# EAGLE design HV-main rev1 (EAGLE 8.1.0)
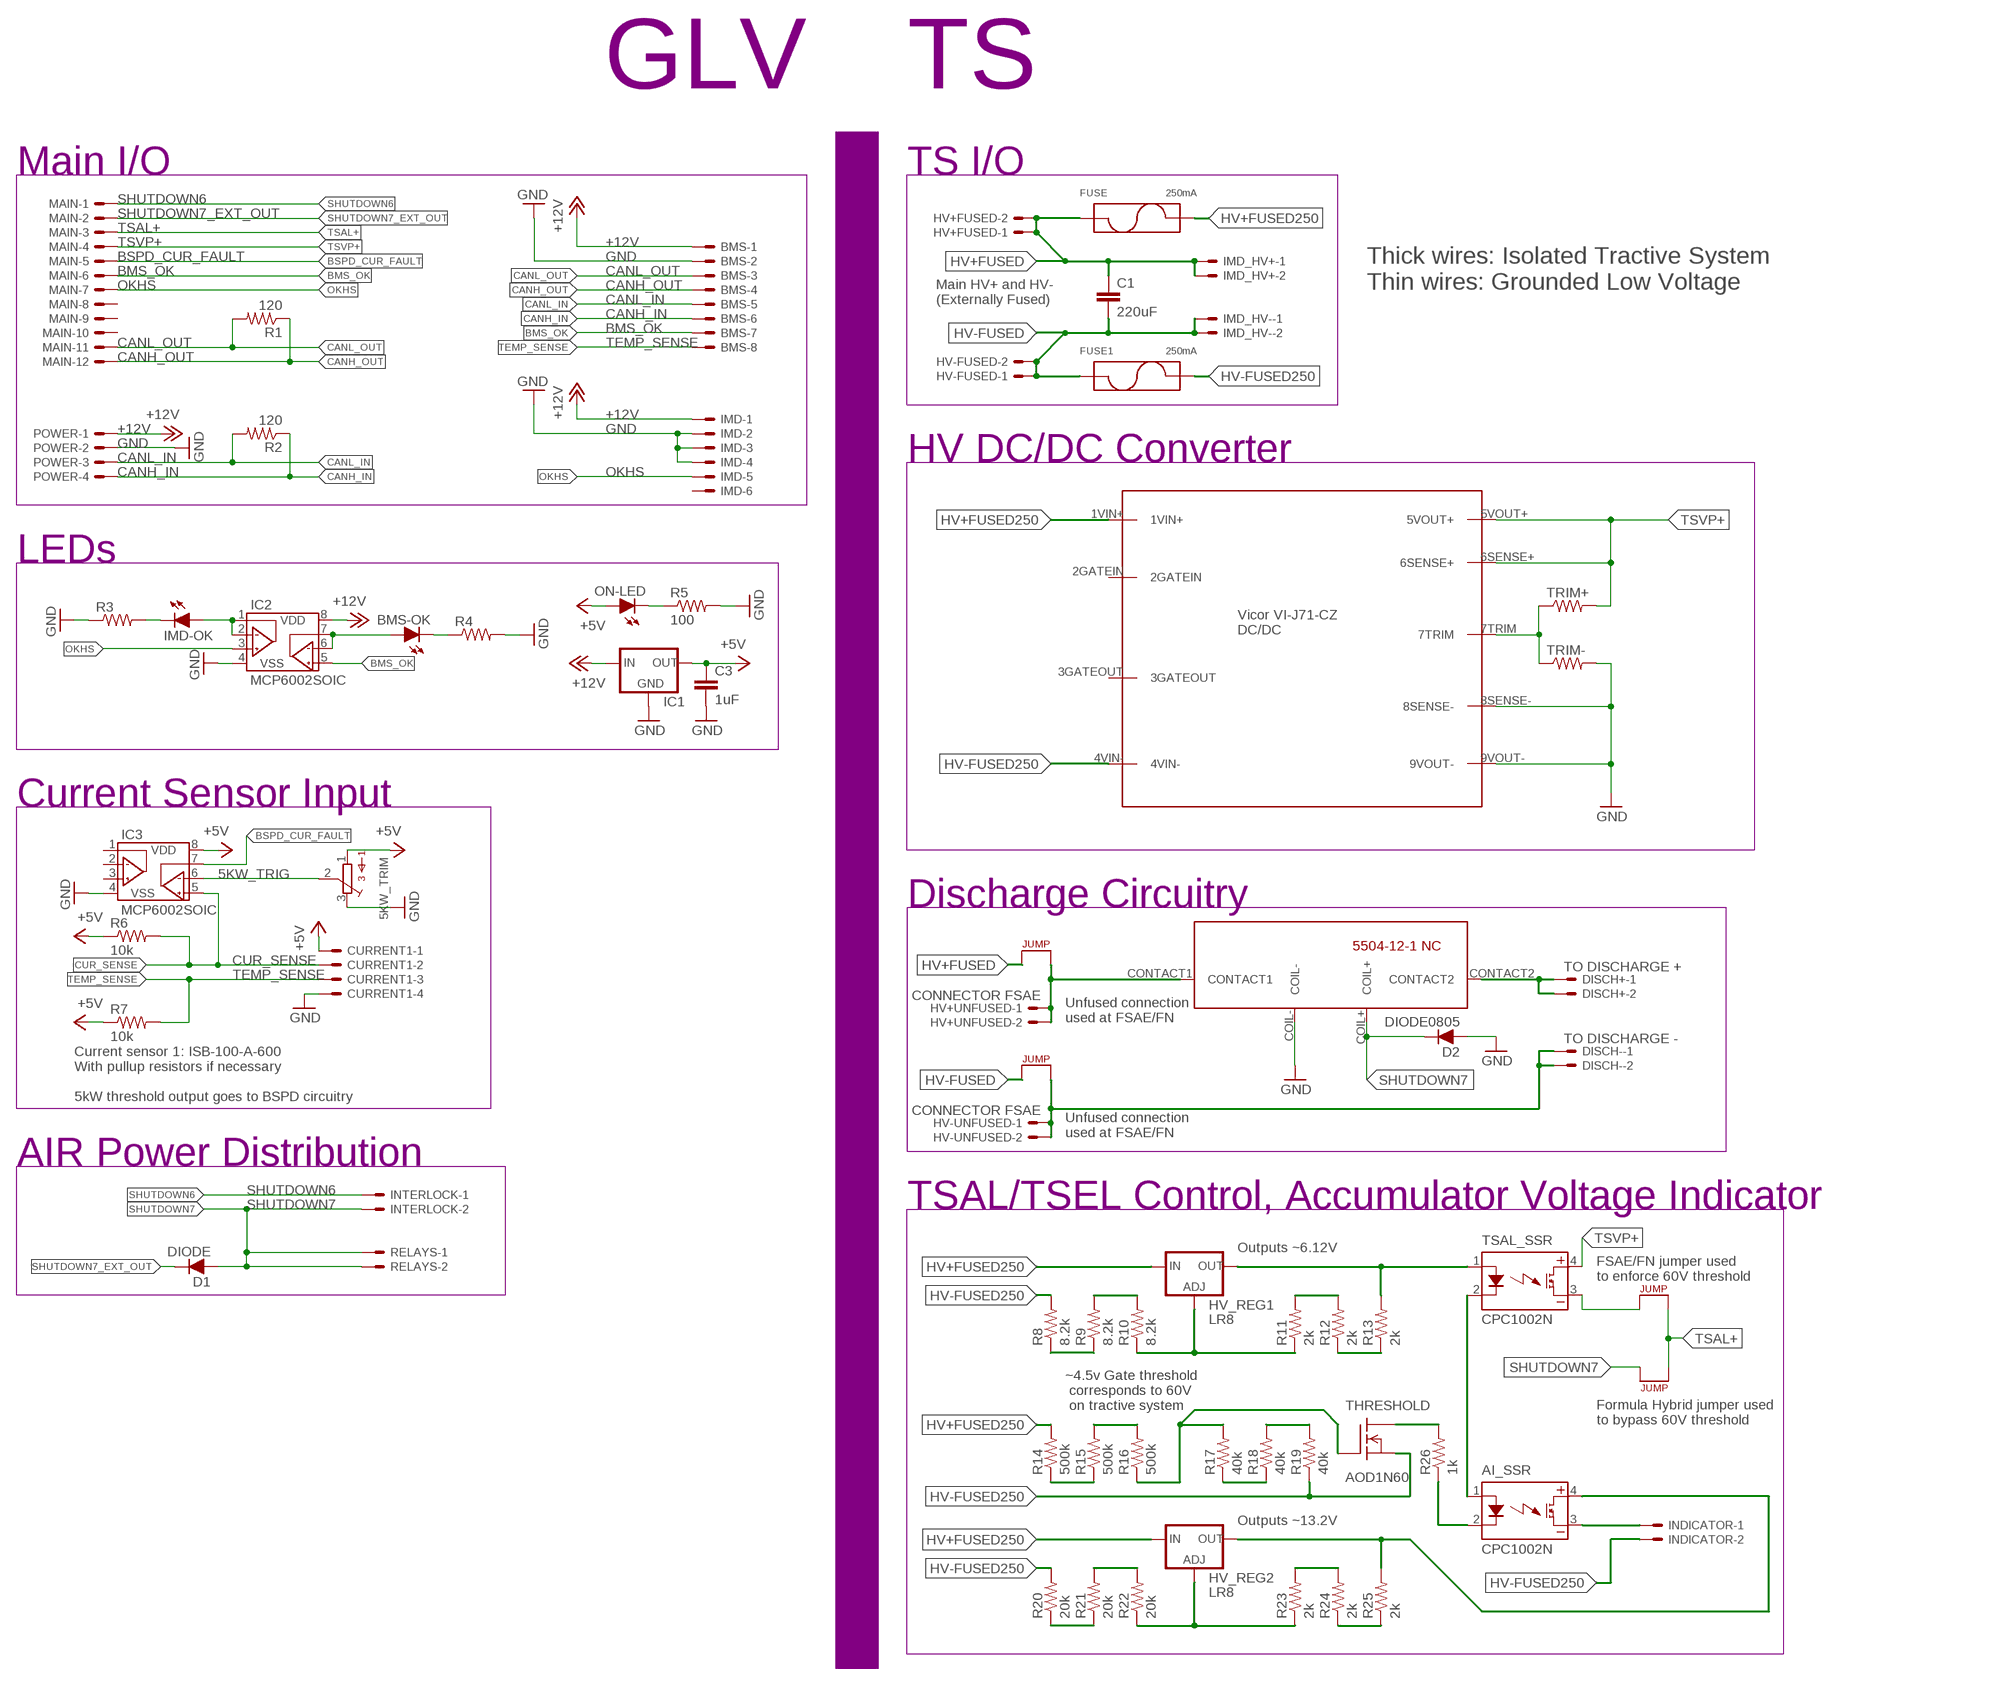
[diagram p0: schematic, sheet 1]

## Parts
5KW_TRIM  TRIMPOT_3296C  [TRIMPOT_3296]
AI_SSR  CPC1002N  [SOP04]
BMS  MINIFIT_5566-8  [MINIFIT_5566-8]
BMS-OK  LED-0805  [LED-805]
C1  220uF  CAP  [LLS2V221MELZ]
C3  1uF  CAP0805  [0805]
CURRENT1  MINIFIT_5566-4  [MINIFIT_5566-4]
D1  DIODE  DIODEDO-41  [DO-41]
D2  DIODE0805  [0805_D]
DISCH+  TO DISCHARGE +  MINIFIT_5566-2  [MINIFIT_5566-2]
DISCH-  TO DISCHARGE -  MINIFIT_5566-2  [MINIFIT_5566-2]
FUSE  250mA  FUSE_MIDGET  [1A3400_38.1MM]
FUSE1  250mA  FUSE_MIDGET  [1A3400_38.1MM]
HV+FUSED  MINIFIT_5566-2  [MINIFIT_5566-2]
HV+UNFUSED  CONNECTOR FSAE  CONNECTOR-2  [MINIFIT_5566-2]
HV-FUSED  MINIFIT_5566-2  [MINIFIT_5566-2]
HV-UNFUSED  CONNECTOR FSAE  CONNECTOR-2  [MINIFIT_5566-2]
HV_REG1  LR8  HV_LIN_REG_LR8SMD  [TO-252]
HV_REG2  LR8  HV_LIN_REG_LR8SMD  [TO-252]
IC1  5VREG_L7805_VERT  [TO-220]
IC2  MCP6002SOIC  [SOIC-08]
IC3  MCP6002SOIC  [SOIC-08]
IMD  CONNECTOR-6  [MINIFIT_5566-6]
IMD-OK  LED-0805  [LED-805]
IMD_HV+  CONNECTOR-2  [MINIFIT_5566-2]
IMD_HV-  CONNECTOR-2  [MINIFIT_5566-2]
INDICATOR  MINIFIT_5566-2  [MINIFIT_5566-2]
INTERLOCK  MINIFIT_5566-2  [MINIFIT_5566-2]
MAIN  CONNECTOR-12  [MINIFIT_5566-12]
ON-LED  LED-0805  [LED-805]
POWER  MINIFIT_5566-4  [MINIFIT_5566-4]
R1  120  RESISTOR0805-RES  [0805]
R2  120  RESISTOR0805-RES  [0805]
R3  RESISTOR0805-RES  [0805]
R4  RESISTOR0805-RES  [0805]
R5  100  RESISTOR0805-RES  [0805]
R6  10k  RESISTOR0805-RES  [0805]
R7  10k  RESISTOR0805-RES  [0805]
R8  8.2k  RESISTOR0805-RES  [0805]
R9  8.2k  RESISTOR0805-RES  [0805]
R10  8.2k  RESISTOR0805-RES  [0805]
R11  2k  RESISTOR0805-RES  [0805]
R12  2k  RESISTOR0805-RES  [0805]
R13  2k  RESISTOR0805-RES  [0805]
R14  500k  RESISTOR0805-RES  [0805]
R15  500k  RESISTOR0805-RES  [0805]
R16  500k  RESISTOR0805-RES  [0805]
R17  40k  RESISTOR0805-RES  [0805]
R18  40k  RESISTOR0805-RES  [0805]
R19  40k  RESISTOR0805-RES  [0805]
R20  20k  RESISTOR0805-RES  [0805]
R21  20k  RESISTOR0805-RES  [0805]
R22  20k  RESISTOR0805-RES  [0805]
R23  2k  RESISTOR0805-RES  [0805]
R24  2k  RESISTOR0805-RES  [0805]
R25  2k  RESISTOR0805-RES  [0805]
R26  1k  RESISTOR0805-RES  [0805]
RELAYS  MINIFIT_5566-2  [MINIFIT_5566-2]
THRESHOLD  AOD1N60  N-CHANNEL_MOSFETAOD1N60  [TO-252]
TRIM+  RESISTOR0805-RES  [0805]
TRIM-  RESISTOR0805-RES  [0805]
TSAL_SSR  CPC1002N  [SOP04]
U$1  JUMPER.3  [AXIAL-0.3]
U$2  JUMPER.3  [AXIAL-0.3]
U$3  JUMPER.3  [AXIAL-0.3]
U$4  JUMPER.3  [AXIAL-0.3]
U$5  HV_DCDC_VI-J71-CZ  [HV_DCDC_VI-J71-CZ]
U$12  5504-12-1-NC  [5504-12-1-NC]

## Nets
5KW_TRIG: 5KW_TRIM.2 IC3.6(VINB-)
+5V: 5KW_TRIM.1 C3.1 CURRENT1.1 IC1.3(OUT) IC3.8(VDD) ON-LED.A R6.1 R7.1
+12V: BMS.1 IC1.1(IN) IC2.8(VDD) IMD.1 POWER.1
BMS_OK: BMS.7 IC2.5(VINB+) MAIN.6
BSPD_CUR_FAULT: IC3.7(VOUTB) MAIN.5
CANH_IN: BMS.6 POWER.4 R2.1
CANH_OUT: BMS.4 MAIN.12 R1.1
CANL_IN: BMS.5 POWER.3 R2.2
CANL_OUT: BMS.3 MAIN.11 R1.2
CUR_SENSE: CURRENT1.2 IC3.5(VINB+) R6.2
DISCHARGE1: HV+UNFUSED.1 HV+UNFUSED.2 U$3.P$2 U$12.CONTACT1
DISCHARGE2: DISCH+.1 DISCH+.2 U$12.CONTACT2
DISCHARGE3: DISCH-.1 DISCH-.2 HV-UNFUSED.1 HV-UNFUSED.2 U$4.P$2
GND: 5KW_TRIM.3 BMS.2 C3.2 CURRENT1.4 D2.A IC1.2(GND) IC2.4(VSS) IC3.4(VSS) IMD.2 IMD.3 IMD.4 POWER.2 R3.1 R4.2 R5.2 TRIM-.2 U$5.8SENSE- U$5.9VOUT- U$12.COIL-
HV+FUSED: C1.P$1 FUSE.P1 FUSE.P2(P1) HV+FUSED.1 HV+FUSED.2 IMD_HV+.1 IMD_HV+.2 U$3.P$1
HV+FUSED250: FUSE.N3(P2) FUSE.N4(P2) HV_REG1.1(IN) HV_REG2.1(IN) R14.2 U$5.1VIN+
HV-FUSED: C1.P$2 FUSE1.P1 FUSE1.P2(P1) HV-FUSED.1 HV-FUSED.2 IMD_HV-.1 IMD_HV-.2 U$4.P$1
HV-FUSED250: FUSE1.N3(P2) FUSE1.N4(P2) INDICATOR.2 R8.2 R19.1 R20.2 THRESHOLD.3(S) U$5.4VIN-
N$1: AI_SSR.4(DC+) HV_REG2.2(TAB)(OUT) R25.2
N$2: HV_REG1.2(TAB)(OUT) R13.2 TSAL_SSR.1(CONTROL+)
N$3: ON-LED.C R5.1
N$4: TSAL_SSR.3(DC-) U$1.P$1
N$5: AI_SSR.2(CONTROL-) R26.1
N$6: AI_SSR.1(CONTROL+) TSAL_SSR.2(CONTROL-)
N$7: AI_SSR.3(DC-) INDICATOR.1
N$8: R8.1 R9.1
N$9: R26.2 THRESHOLD.2(TAB)(D)
N$10: R14.1 R15.1
N$11: R15.2 R16.2
N$12: R17.1 R18.1
N$13: R18.2 R19.2
N$14: R9.2 R10.2
N$15: HV_REG2.3(ADJ) R22.1 R23.1
N$16: R11.2 R12.2
N$17: R12.1 R13.1
N$18: HV_REG1.3(ADJ) R10.1 R11.1
N$19: R23.2 R24.2
N$20: R24.1 R25.1
N$21: R21.2 R22.2
N$22: R16.1 R17.2 THRESHOLD.1(G)
N$23: R20.1 R21.1
N$42: IC2.1(VOUTA) IC2.2(VINA-) IMD-OK.A
N$43: BMS-OK.A IC2.6(VINB-) IC2.7(VOUTB)
N$44: BMS-OK.C R4.1
N$45: IMD-OK.C R3.2
OKHS: IC2.3(VINA+) IMD.5 MAIN.7
SHUTDOWN6: INTERLOCK.1 MAIN.1
SHUTDOWN7: D1.A D2.C INTERLOCK.2 RELAYS.1 RELAYS.2 U$2.P$2 U$12.COIL+
SHUTDOWN7_EXT_OUT: D1.C MAIN.2
TEMP_SENSE: BMS.8 CURRENT1.3 R7.2
TRIM: TRIM+.1 TRIM-.1 U$5.7TRIM
TSAL+: MAIN.3 U$1.P$2 U$2.P$1
TSVP+: MAIN.4 TRIM+.2 TSAL_SSR.4(DC+) U$5.5VOUT+ U$5.6SENSE+
Unconnected: IC3.1(VOUTA) IC3.2(VINA-) IC3.3(VINA+) IMD.6 MAIN.8 MAIN.9 MAIN.10 U$5.2GATEIN U$5.3GATEOUT

## Notes on the sheet
- GLV
- TS
- Main I/O | TS I/O
- Thick wires: Isolated Tractive System
  Thin wires: Grounded Low Voltage
- Main HV+ and HV-
  (Externally Fused)
- HV DC/DC Converter
- LEDs
- Current Sensor Input
- Discharge Circuitry
- Unfused connection
  used at FSAE/FN
- Current sensor 1: ISB-100-A-600
  With pullup resistors if necessary
  
  5kW threshold output goes to BSPD circuitry
- Unfused connection
  used at FSAE/FN
- AIR Power Distribution
- TSAL/TSEL Control, Accumulator Voltage Indicator
- Outputs ~6.12V
- FSAE/FN jumper used
  to enforce 60V threshold
- ~4.5v Gate threshold
   corresponds to 60V
   on tractive system
- Formula Hybrid jumper used
  to bypass 60V threshold
- Outputs ~13.2V

## Library data of the parts
5KW_TRIM = HyTechDevices:TRIMPOT_3296: 3296 Series 3/8" Square Trimmer Source <https://github.com/chiengineer/Eagle-Libraries/blob/master/Potentiometers/bourns.lbr>
AI_SSR TSAL_SSR = HyTechDevices:CPC1002N: IXYS Solid State Relay .7A
BMS = HyTechDevices:MINIFIT_5566-8: Mini-Fit Junior connector 8 pole Source: http://www.molex.com; OC_FARNELL: unknown; OC_NEWARK: unknown
BMS-OK IMD-OK ON-LED = HyTechDevices:LED: Light Emitting Diode (LED) Source: Dangerous Prototypes Eagle Library <https://github.com/DangerousPrototypes/Eagle_Part_Library>
C1 C3 = HyTechDevices:CAP: Capacitor Standard 0603 ceramic capacitor, and 0.1" leaded capacitor.
CURRENT1 POWER = HyTechDevices:MINIFIT_5566-4: Mini-Fit Junior connector 4 pole Source: http://www.molex.com; OC_FARNELL: unknown; OC_NEWARK: unknown
D1 D2 = HyTechDevices:DIODE: DIODE general purpose rectifier
DISCH+ DISCH- HV+FUSED HV-FUSED INDICATOR INTERLOCK RELAYS = HyTechDevices:MINIFIT_5566-2: Mini-Fit Junior connector 2 pole Source: http://www.molex.com; OC_FARNELL: 1822072; OC_NEWARK: unknown
FUSE FUSE1 = HyTechDevices:FUSE: Fuse/Fuseclips Keystone Electronics 3568 Fuse Mouser Part <http://www.mouser.com/ProductDetail/Keystone-Electronics/3568> Datasheet <http://www.mouser.com/ds/2/215/568-742601.pdf> Bussman/Eaton Midget Fuse Clip 1A3400 <http://www.mouser.com/ProductDetail/Bussmann-Eaton/BK-1A3400-09-R/?qs=sGAEpiMZZMuG%252bgnN5hGYGzzlAelq2OxnKqVSMVjq8I4%3d> Schurter 0751.0110 Brass Fuse Clip Datasheet <http://www.mouser.com/ds/2/358/typ_OG__Clip__5x20-2553.pdf>
HV+UNFUSED HV-UNFUSED IMD_HV+ IMD_HV- = HyTechDevices:CONNECTOR-2: Mini-Fit Junior connector 2 pole Source: http://www.molex.com; OC_FARNELL: 1822072; OC_NEWARK: unknown
HV_REG1 HV_REG2 = HyTechDevices:HV_LIN_REG_LR8
IC1 = HyTechDevices:5VREG_L7805: Voltage Regulator Switching 5v regulator Datasheet <http://power.murata.com/data/power/oki-78sr.pdf> Standard 7805 5V regulator. IGO (Input Ground Output). Spark Fun Electronics SKU : COM-00107 Datasheet <http://www.mouser.com/ds/2/308/MC7800-D-94905.pdf>
IC2 IC3 = HyTechDevices:MCP6002: Microchip MCP6002 Dual Channel Op Amp
IMD = HyTechDevices:CONNECTOR-6: Mini-Fit Junior connector 6 pole Source: http://www.molex.com; MPN: 95566-61002; OC_FARNELL: unknown; OC_NEWARK: 22K8620
MAIN = HyTechDevices:CONNECTOR-12: Mini-Fit Junior connector 12 pole Source: http://www.molex.com; OC_FARNELL: unknown; OC_NEWARK: unknown
R1-R26 TRIM+ TRIM- = HyTechDevices:RESISTOR: Resistor Basic schematic elements and footprints for 0603, 1206, and PTH resistors.
THRESHOLD = HyTechDevices:N-CHANNEL_MOSFET: Generic N-Channel MOSFET
U$1-U$4 = HyTechDevices:JUMPER: Jumper for changing operation of a device
U$5 = HyTechDevices:HV_DCDC_VI-J71-CZ: Vicor-Corporation VI-J71-CZ Product Page <https://www.digikey.com/product-detail/en/vicor-corporation/VI-J71-CZ/1102-1486-ND/2996194> Datasheet <http://cdn.vicorpower.com/documents/datasheets/ds_vi-j00.pdf>
U$12 = HyTechDevices:5504-12-1-NC: Relay 5504-12-1 Normally Closed(Form B)

## Board
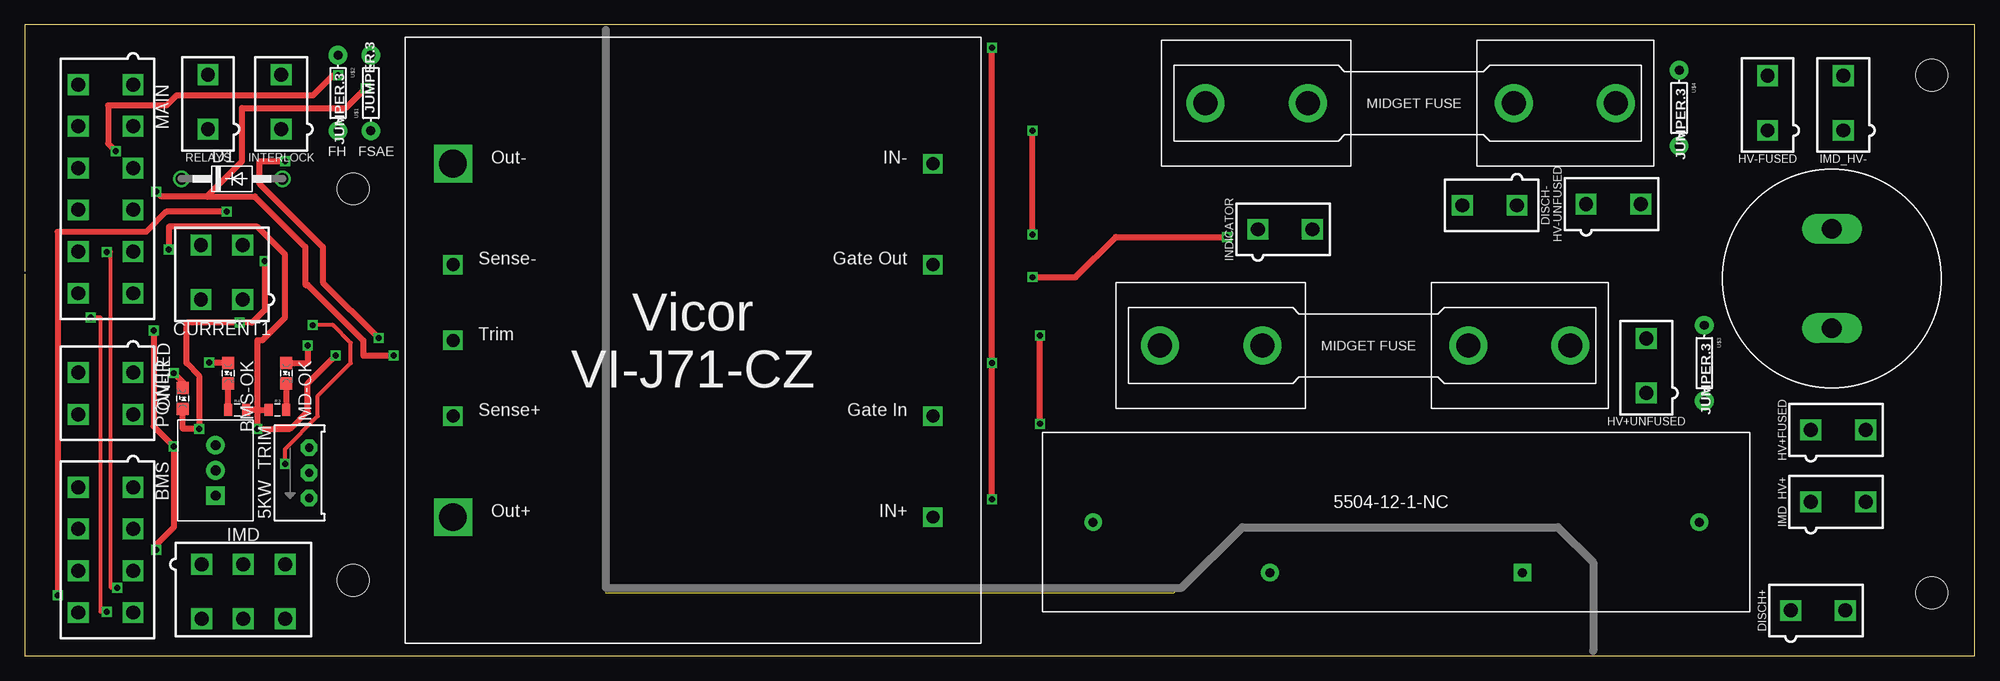
[diagram p1: board, top side]
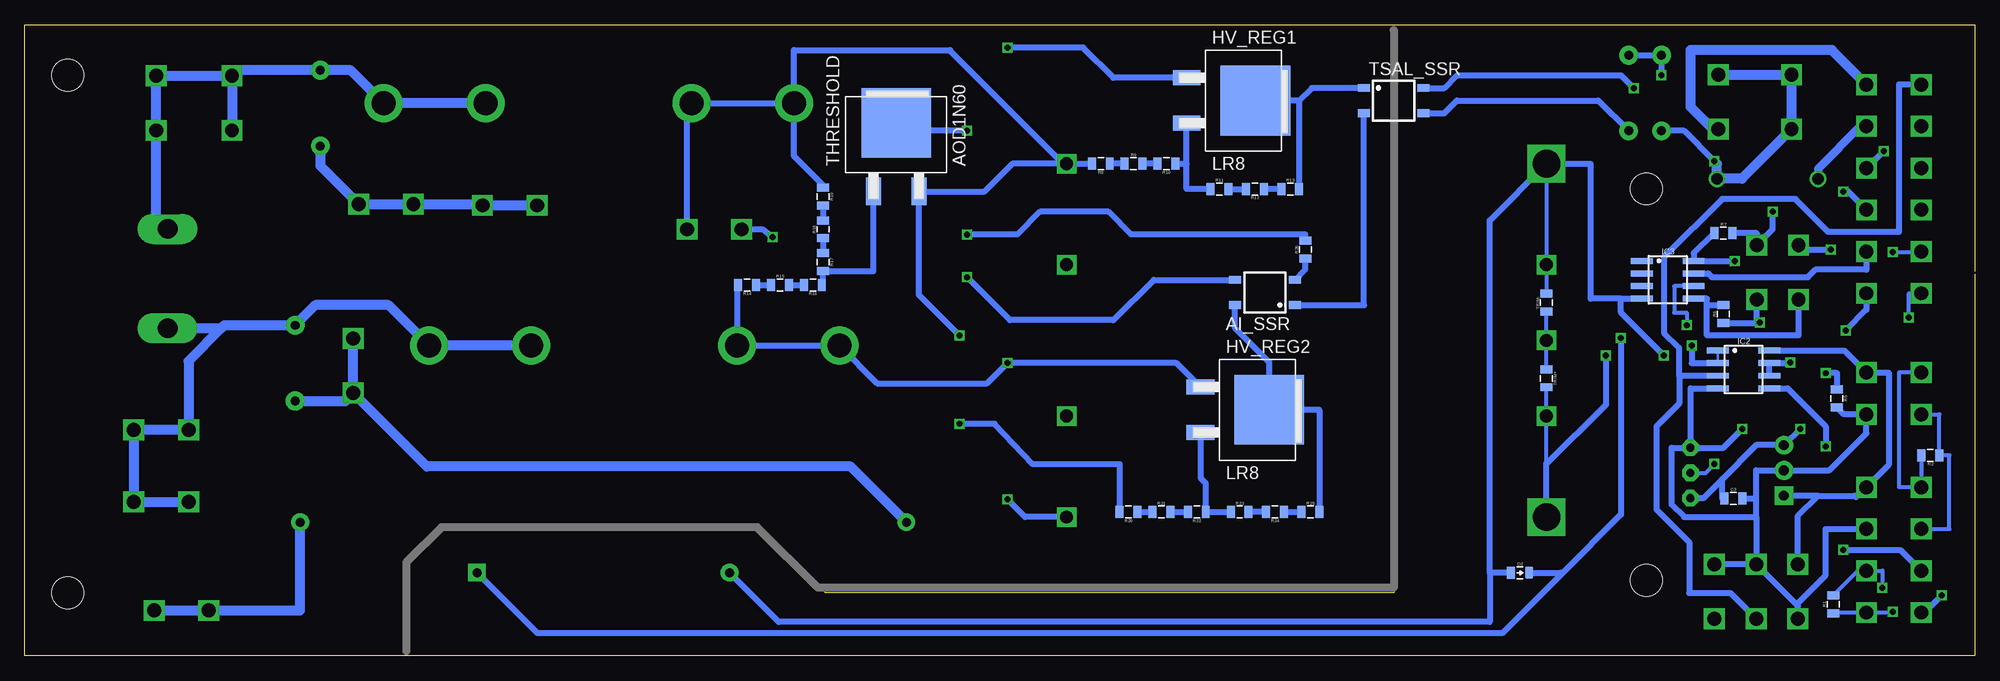
[diagram p2: board, bottom side, seen from below]

Size 196.09 x 63.5 mm. Coordinates in mm from the lower left corner, seen from the top.
Outline: 0,38.69 0,63.5 196.09,63.5 196.09,0 0,0 0,38.43
Copper layers (1*16): Top 0.035mm / dielectric 1.5mm / Bottom 0.035mm
Design rules "default": minimum track width 10mil, minimum drill 24mil, track to track 8mil, track to pad 8mil, pad to pad 8mil, via to via 8mil, smd to smd 8mil, copper to edge 40mil, drill to drill 8mil, minimum pad ring 10mil, minimum via ring 8mil, stop-mask expansion 4mil, vias tented up to drill 0mil, thermal gap 10mil
Holes 3.2 mm at 33.02,46.99 33.02,7.62 191.77,6.35 191.77,58.42

### Footprints (pad centres in the part's own frame; a part is rotated, then mirrored left to right if it is on the bottom)
TRIMPOT_3296 = drill 0.813 pad 1.676 octagon: 1 2.54,1.27; 2 0,1.27; 3 -2.54,1.27
SOP04 = smd 0.8 x 1.2: 1 -1.27,-3; 2 1.27,-3; 3 1.27,3; 4 -1.27,3
MINIFIT_5566-8 = drill 1.4 square: 1 6.3,-2.75; 2 2.1,-2.75; 3 -2.1,-2.75; 4 -6.3,-2.75; 5 6.3,2.75; 6 2.1,2.75; 7 -2.1,2.75; 8 -6.3,2.75
LED-805 = smd 1.2 x 1.2: A 0,-1.05; C 0,1.05
LLS2V221MELZ = drill 2 long: P$1 -5,0; P$2 5,0
0805 = smd 0.8 x 1.2: 1 -0.9,0; 2 0.9,0
MINIFIT_5566-4 = drill 1.4 square: 1 2.1,-2.75; 2 -2.1,-2.75; 3 2.1,2.75; 4 -2.1,2.75
DO-41 = drill 1.118: A 5.08,0; C -5.08,0
0805_D = smd 0.8 x 1.2: A -0.9,0; C 0.9,0
MINIFIT_5566-2 = drill 1.4 square: 1 0,-2.75; 2 0,2.75
1A3400_38.1MM = drill 2.413 pad 3.81: N3 30.988,0; N4 41.275,0; P1 0,0; P2 10.287,0
TO-252 = smd 1.499 x 2.794: 1 -2.286,0; 3 2.286,0 | smd 7.01 x 7.01: 2(TAB) 0,6.909
TO-220 = drill 1 pad 1.88 square: 1 -2.54,0 | drill 1 pad 1.88: 2 0,0; 3 2.54,0
SOIC-08 = smd 0.6 x 2.2: 1 -1.905,-2.6; 2 -0.635,-2.6; 3 0.635,-2.6; 4 1.905,-2.6; 5 1.905,2.6; 6 0.635,2.6; 7 -0.635,2.6; 8 -1.905,2.6
MINIFIT_5566-6 = drill 1.4 square: 1 4.2,-2.75; 2 0,-2.75; 3 -4.2,-2.75; 4 4.2,2.75; 5 0,2.75; 6 -4.2,2.75
MINIFIT_5566-12 = drill 1.4 square: 1 10.5,-2.75; 2 6.3,-2.75; 3 2.1,-2.75; 4 -2.1,-2.75; 5 -6.3,-2.75; 6 -10.5,-2.75; 7 10.5,2.75; 8 6.3,2.75; 9 2.1,2.75; 10 -2.1,2.75; 11 -6.3,2.75; 12 -10.5,2.75
AXIAL-0.3 = drill 0.9 pad 1.88: P$1 -3.81,0; P$2 3.81,0
HV_DCDC_VI-J71-CZ = drill 1.3 square: 1VIN+ 5.08,-12.7; 2GATEIN 5.08,-22.86; 3GATEOUT 5.08,-38.1; 4VIN- 5.08,-48.26; 6SENSE+ 53.34,-22.86; 7TRIM 53.34,-30.48; 8SENSE- 53.34,-38.1 | drill 2.8 square: 5VOUT+ 53.34,-12.7; 9VOUT- 53.34,-48.26
5504-12-1-NC = drill 0.9 pad 1.778 square: COIL+ 48.26,-14.097 | drill 0.9 pad 1.778: COIL- 22.86,-14.097; CONTACT1 5.08,-9.017; CONTACT2 66.04,-9.017

### Placement (x,y rotation side)
5KW_TRIM  27.3,18.41 270 top
AI_SSR  71.37,36.58 90 bottom
BMS  8.13,10.67 90 top
BMS-OK  20.45,28.45 180 top
C1  181.74,37.97 90 top
C3  24.26,15.88 0 bottom
CURRENT1  19.81,38.61 0 top
D1  20.83,48.01 0 top
D2  45.72,8.38 0 bottom
DISCH+  180.34,4.57 270 top
DISCH-  147.32,45.34 90 top
FUSE  155.45,31.24 180 top
FUSE1  160.02,55.63 180 top
HV+FUSED  182.37,22.73 270 top
HV+UNFUSED  163.07,29.21 0 top
HV-FUSED  175.26,55.63 0 top
HV-UNFUSED  159.77,45.47 270 top
HV_REG1  79.25,55.88 270 bottom
HV_REG2  77.85,24.77 270 bottom
IC1  19.18,18.67 90 top
IC2  23.24,28.83 270 bottom
IC3  30.86,37.85 270 bottom
IMD  21.97,6.48 180 top
IMD-OK  26.29,28.45 180 top
IMD_HV+  182.37,15.49 270 top
IMD_HV-  182.88,55.63 0 top
INDICATOR  126.75,42.93 270 top
INTERLOCK  25.78,55.75 0 top
MAIN  8.13,46.99 90 top
ON-LED  15.88,25.91 0 top
POWER  8.13,26.42 90 top
R1  14.22,5.21 90 bottom
R2  4.45,20.19 180 bottom
R3  25.4,24.77 0 top
R4  21.34,24.77 0 top
R5  13.84,25.91 270 bottom
R6  25.27,34.42 90 bottom
R7  25.27,42.55 0 bottom
R8  87.88,49.53 180 bottom
R9  84.58,49.53 0 bottom
R10  81.28,49.53 180 bottom
R11  75.95,46.99 0 bottom
R12  72.39,46.99 180 bottom
R13  68.83,46.99 0 bottom
R14  123.44,37.34 180 bottom
R15  120.14,37.34 0 bottom
R16  116.84,37.34 180 bottom
R17  115.82,39.62 270 bottom
R18  115.82,42.93 90 bottom
R19  115.82,46.23 270 bottom
R20  85.09,14.48 180 bottom
R21  81.79,14.48 0 bottom
R22  78.23,14.48 180 bottom
R23  73.91,14.48 0 bottom
R24  70.36,14.48 180 bottom
R25  66.8,14.48 0 bottom
R26  67.31,40.89 90 bottom
RELAYS  18.41,55.75 0 top
THRESHOLD  108.46,46.74 0 bottom
TRIM+  43.05,27.94 270 bottom
TRIM-  43.05,35.56 90 bottom
TSAL_SSR  58.42,55.88 270 bottom
U$1  34.8,56.64 90 top
U$2  31.5,56.64 270 top
U$3  168.91,29.46 270 top
U$4  166.37,55.12 270 top
U$5  96.39,1.27 180 top
U$12  102.36,22.48 0 top

### Tracks (layer width: path | path; a pad name or v marks a point on that pad's centre or on a via)
5KW_TRIG  (via drill 0.6)
  Top 0.406: v28.96,33.27 30.99,33.27 32.77,31.5 32.77,29.46 29.46,26.16 29.46,24.13 26.16,20.83 v26.16,19.3
  Bottom 0.406: IC3.6 30.23,37.21 30.23,34.54 28.96,34.54 v28.96,33.27 | 5KW_TRIM.2 27.05,18.41 v26.16,19.3
+5V  (via drill 0.6)
  Top 0.61: 15.91,24.89 ON-LED.A 15.88,22.86 v17.53,22.86 17.53,28.19 16.26,29.46 16.26,33.53 v21.59,33.53 22.86,33.53 24.13,34.8 v24.13,39.75
  Bottom 0.61: 5KW_TRIM.1 27.3,15.88 25.4,17.78 | 25.4,17.78 21.97,21.21 IC1.3 v17.53,22.86 | C3.1 25.4,15.88 25.4,17.78 | R7.1 28.26,40.51 IC3.8 v24.13,39.75 | 21.91,33.53 v21.59,33.53 | 21.91,33.53 CURRENT1.1 | R6.1 21.91,33.52 21.91,33.53
+12V
  Bottom 0.61: 17.77,10.17 IMD.1 17.77,14.11 15.75,16.13 | 15.75,16.13 IC1.1 | 15.75,16.13 12.06,16.13 11.94,16 10.97,16.97 BMS.1 8.64,19.21 8.64,28.52 POWER.1 13.1,30.73 IC2.8
BMS_OK  (via drill 0.6)
  Top 0.61: v13.21,10.67 13.21,11.18 14.99,12.95 v14.99,21.08 12.95,23.11 v12.95,32.77
  Bottom 0.61: IC2.5 18.8,26.92 14.99,23.11 v14.99,21.08 | v13.21,10.67 7.48,10.67 BMS.7 | MAIN.6 10.88,34.84 v12.95,32.77
BSPD_CUR_FAULT
  Bottom 0.61: MAIN.5 10.88,38.86 16,38.86 16.76,38.1 26.42,38.1 26.8,38.48 IC3.7
CANH_IN
  Bottom 0.406: POWER.4 3.54,24.32 R2.1 2.54,20.19 2.54,12.77 BMS.6
CANH_OUT  (via drill 0.6)
  Top 0.406: v8.26,4.45 7.62,4.45 7.62,34.04 v6.6,34.04
  Bottom 0.406: R1.1 14.22,4.37 BMS.4 8.26,4.37 v8.26,4.45 | v6.6,34.04 6.6,36.49 MAIN.12
CANL_IN
  Bottom 0.406: POWER.3 7.62,28.52 7.62,16.97 BMS.5 5.38,20.19 R2.2
CANL_OUT  (via drill 0.6)
  Top 0.406: v9.27,6.86 8.64,6.86 8.64,40.64 v8.26,40.64
  Bottom 0.406: R1.2 11.76,8.57 BMS.3 9.27,8.57 v9.27,6.86 | v8.26,40.64 5.63,40.64 MAIN.11
CUR_SENSE
  Bottom 0.61: CURRENT1.2 17.71,32.26 26.92,32.26 26.92,35.31 | 26.92,35.31 25.27,35.31 R6.2 | 26.92,35.31 26.92,35.94 IC3.5
DISCHARGE1
  Bottom 1.016: HV+UNFUSED.1 HV+UNFUSED.2 | U$12.CONTACT1 113.03,19.05 155.66,19.05 HV+UNFUSED.1 | U$3.P$2 163.87,25.65 HV+UNFUSED.1
DISCHARGE2
  Bottom 1.016: DISCH+.2 DISCH+.1 168.4,4.57 U$12.CONTACT2
DISCHARGE3
  Bottom 1.016: DISCH-.2 DISCH-.1 150.07,45.47 HV-UNFUSED.1 HV-UNFUSED.2 166.37,49.32 U$4.P$2
GND  (via drill 0.6)
  Top 0.61: 23.37,24.77 R4.2 | 23.37,24.77 R3.1 | 23.37,24.77 v23.37,22.86 26.67,22.86 28.45,24.64 28.45,27.43 v31.24,30.23 | v14.48,40.89 14.48,43.18 23.37,43.18 26.16,40.39 26.16,34.04 23.88,31.75 23.37,31.75 23.37,24.77
  Bottom 0.406: TRIM-.2 U$5.8SENSE- U$5.9VOUT-
  Bottom 0.61: IMD.2 IMD.3 | IMD.4 17.77,5.03 18.06,5.31 | 18.06,5.31 IMD.2 | 21.97,15.88 21.97,18.67 IC1.2 14.61,18.67 10.88,22.4 POWER.2 13.15,24.32 R5.2 | 21.97,13.97 21.97,15.88 | 21.97,13.97 IMD.2 | C3.2 21.97,15.88 | 5KW_TRIM.3 30.48,20.95 30.48,15.24 29.21,13.97 21.97,13.97 | 5KW_TRIM.3 25.27,20.95 v23.37,22.86 | 18.06,5.31 17.8,5.31 14.99,8.13 14.99,12.77 BMS.2 | 5KW_TRIM.3 28.57,26.92 IC2.4 | CURRENT1.4 17.25,40.89 v14.48,40.89 | U$5.9VOUT- 38.61,49.53 38.61,35.94 35.56,35.94 | 35.56,35.94 IC3.4 | 43.18,49.53 U$5.9VOUT- | v31.24,30.23 35.56,34.54 35.56,35.94 | U$5.9VOUT- 48.77,43.81 48.77,8.38 | 48.77,8.38 48.77,3.43 120.27,3.43 U$12.COIL- | D2.A 48.77,8.38
HV+FUSED
  Bottom 1.016: FUSE.P2 FUSE.P1 159.51,35.31 166.88,35.31 U$3.P$1 176.02,33.27 176.32,32.97 | IMD_HV+.1 IMD_HV+.2 HV+FUSED.2 HV+FUSED.1 179.62,29.67 176.32,32.97 | C1.P$1 176.32,32.97
HV+FUSED250  (via drill 0.6)
  Top 0.61: v97.28,61.21 v97.28,29.46 v97.28,15.75
  Bottom 0.61: v97.28,61.21 89.66,61.21 86.61,58.17 HV_REG1.1 | HV_REG2.1 80.26,29.46 v97.28,29.46 99.31,27.43 110.36,27.43 FUSE.N4 FUSE.N3 124.46,37.22 R14.2 | U$5.1VIN+ 95.5,13.97 v97.28,15.75
HV-FUSED
  Bottom 1.016: HV-FUSED.2 HV-FUSED.1 | FUSE1.P2 FUSE1.P1 163.32,58.93 U$4.P$1 174.71,58.93 HV-FUSED.2 | HV-FUSED.2 IMD_HV-.2 IMD_HV-.1 182.88,44.12 C1.P$2
HV-FUSED250  (via drill 0.6)
  Top 0.61: v102.11,23.37 v102.11,32.26
  Bottom 0.61: 91.69,49.53 U$5.4VIN- R8.2 | 91.69,49.53 96.77,49.53 99.57,46.74 THRESHOLD.3 106.17,36.32 v102.11,32.26 | FUSE1.N4 FUSE1.N3 129.5,55.16 INDICATOR.2 | FUSE1.N4 118.75,60.96 103,60.96 103,60.83 91.69,49.53 | v102.11,23.37 98.55,23.37 94.74,19.3 85.99,19.3 R20.2 | FUSE1.N4 118.75,50.3 115.82,47.38 R19.1
N$1
  Bottom 0.61: R25.2 65.9,24.77 HV_REG2.2(TAB) 70.94,29.54 74.37,32.97 AI_SSR.4
N$2
  Bottom 0.61: 73.36,57.15 HV_REG1.2(TAB) 67.93,55.88 | 67.93,55.88 R13.2 | 67.93,55.88 66.66,57.15 TSAL_SSR.1
N$3  (via drill 0.6)
  Top 0.61: v14.99,28.45 15.88,27.56 ON-LED.C
  Bottom 0.61: v14.99,28.45 13.84,28.45 R5.1
N$4
  Bottom 0.61: U$1.P$1 37.85,55.88 52.07,55.88 53.34,54.61 TSAL_SSR.3
N$5
  Bottom 0.61: R26.1 67.31,38.91 AI_SSR.2
N$6
  Bottom 0.61: AI_SSR.1 61.42,35.31 TSAL_SSR.2
N$7  (via drill 0.6)
  Top 0.61: v120.9,42.16 109.73,42.16 105.66,38.1 v101.35,38.1
  Bottom 0.61: AI_SSR.3 82.55,37.85 86.61,33.78 97.03,33.78 v101.35,38.1 | INDICATOR.1 121.92,42.93 v120.9,42.16
N$8
  Bottom 0.61: R9.1 R8.1
N$9  (via drill 0.6)
  Top 0.61: v101.35,42.42 v101.35,52.83
  Bottom 0.61: R26.2 67.31,42.42 84.84,42.42 87.12,44.7 93.98,44.7 96.27,42.42 v101.35,42.42 | v101.35,52.83 107.64,52.83 THRESHOLD.2(TAB)
N$10
  Bottom 0.61: R14.1 R15.1
N$11
  Bottom 0.61: R15.2 R16.2
N$12
  Bottom 0.61: R18.1 R17.1
N$13
  Bottom 0.61: R19.2 R18.2
N$14
  Bottom 0.61: R10.2 R9.2
N$15
  Bottom 0.61: R23.1 R22.1 77.33,17.39 77.85,17.91 HV_REG2.3 77.72,22.48
N$16
  Bottom 0.61: R11.2 R12.2
N$17
  Bottom 0.61: R13.1 R12.1
N$18
  Bottom 0.61: 79.25,49.53 HV_REG1.3 | R10.1 79.25,49.53 | 79.25,49.53 79.25,46.99 R11.1
N$19
  Bottom 0.61: R24.2 R23.2
N$20
  Bottom 0.61: R24.1 R25.1
N$21
  Bottom 0.61: R21.2 R22.2
N$22
  Bottom 0.61: THRESHOLD.1 110.74,38.72 R17.2 115.82,37.34 R16.1
N$23
  Bottom 0.61: R20.1 R21.1
N$24  (6 unrouted)
N$42  (via drill 0.6)
  Top 0.61: IMD-OK.A 28.48,29.5 28.48,31.24 v28.45,31.24
  Bottom 0.254: IC2.1 IC2.2
  Bottom 0.61: IC2.2 28.45,29.46 v28.45,31.24
N$43  (via drill 0.6)
  Top 0.61: v18.54,29.51 20.18,29.51 BMS-OK.A
  Bottom 0.61: IC2.6 IC2.7 18.59,29.46 v18.54,29.51
N$44
  Top 0.61: BMS-OK.C R4.1
N$45
  Top 0.61: IMD-OK.C R3.2
OKHS
  Bottom 0.61: IMD.5 24.59,6.35 28.7,6.35 28.7,11.43 32,14.73 32,23.11 29.72,25.4 29.72,28.19 | MAIN.7 7.62,57.49 7.62,42.67 14.73,42.67 18.03,45.97 25.4,45.97 31.24,40.13 31.24,32.51 29.72,30.99 29.72,28.19 | IC2.3 29.72,28.19
SHUTDOWN6
  Bottom 1.016: INTERLOCK.1 26.33,53 28.57,55.24 28.57,60.96 14.35,60.96 MAIN.1
SHUTDOWN7  (via drill 0.6)
  Top 0.61: v26.16,49.78 23.62,49.78 23.62,47.5 29.97,41.15 29.97,37.59 v35.56,32
  Bottom 0.61: U$2.P$2 29.21,52.83 v26.16,49.78 25.91,49.53 | v35.56,32 35.56,14.22 41.53,8.26 | 41.53,8.26 47.5,2.29 144.53,2.29 U$12.COIL+ | D2.C 41.66,8.38 41.53,8.26
  Bottom 1.016: INTERLOCK.2 RELAYS.2 RELAYS.1 23.41,48.01 D1.A 25.91,49.53
SHUTDOWN7_EXT_OUT
  Bottom 0.813: MAIN.2 11.48,53.29 15.75,49.02 D1.C
TEMP_SENSE  (via drill 0.6)
  Top 0.61: v20.32,44.7 14.22,44.7 12.19,42.67 3.3,42.67 v3.3,6.1
  Bottom 0.61: R7.2 21.91,42.55 CURRENT1.3 20.32,42.95 v20.32,44.7 | v3.3,6.1 5.03,4.37 BMS.8
TRIM
  Bottom 0.406: TRIM-.1 U$5.7TRIM TRIM+.1
TSAL+  (via drill 0.6)
  Top 0.61: v9.14,50.8 8.38,51.56 8.38,55.37 14.22,55.37 15.24,56.39 28.96,56.39 30.99,58.42 v31.5,58.42
  Bottom 0.61: U$1.P$2 U$2.P$1 v31.5,58.42 | MAIN.3 10.85,49.09 v9.14,50.8
TSVP+  (via drill 0.6)
  Top 0.61: 18.29,46.23 21.84,49.78 21.84,55.12 32.26,55.12 v34.29,57.15 | 18.29,46.23 13.72,46.23 v13.21,46.74 | 18.29,46.23 23.11,46.23 28.19,41.15 28.19,37.34 28.45,37.34 34.04,31.75 34.04,30.23 v37.08,30.23
  Bottom 0.406: TRIM+.2 U$5.6SENSE+ 43.05,19.3
  Bottom 0.61: v34.29,57.15 35.56,58.42 52.07,58.42 53.34,57.15 TSAL_SSR.4 | U$5.5VOUT+ 43.05,19.3 | 43.05,19.3 43.05,19.43 | v13.21,46.74 12.72,46.74 MAIN.4 | v37.08,30.23 37.08,25.27 43.05,19.3

### Text on the board
tPlace: FH | FSAE
bTest: DANGER HIGH VOLTAGE | DANGER HIGH VOLTAGE
tDocu: TS | GLV | - | DANGER / HIGH / VOLTAGE | FH JUMP | DANGER HIGH VOLTAGE | Low / Voltage / Side | hv_board_rev1 | FH JUMP | GLV | TS | TS | GLV | + | GLV | TS | TS | TS | GLV | GLV | GLV | TS
bDocu: GLV | TS | DANGER HIGH VOLTAGE | GLV | TS | TS | GLV | TS | GLV | TS | TS | GLV | TS | GLV | GLV